# Altium schematic sheet PIC.SchDoc
size A
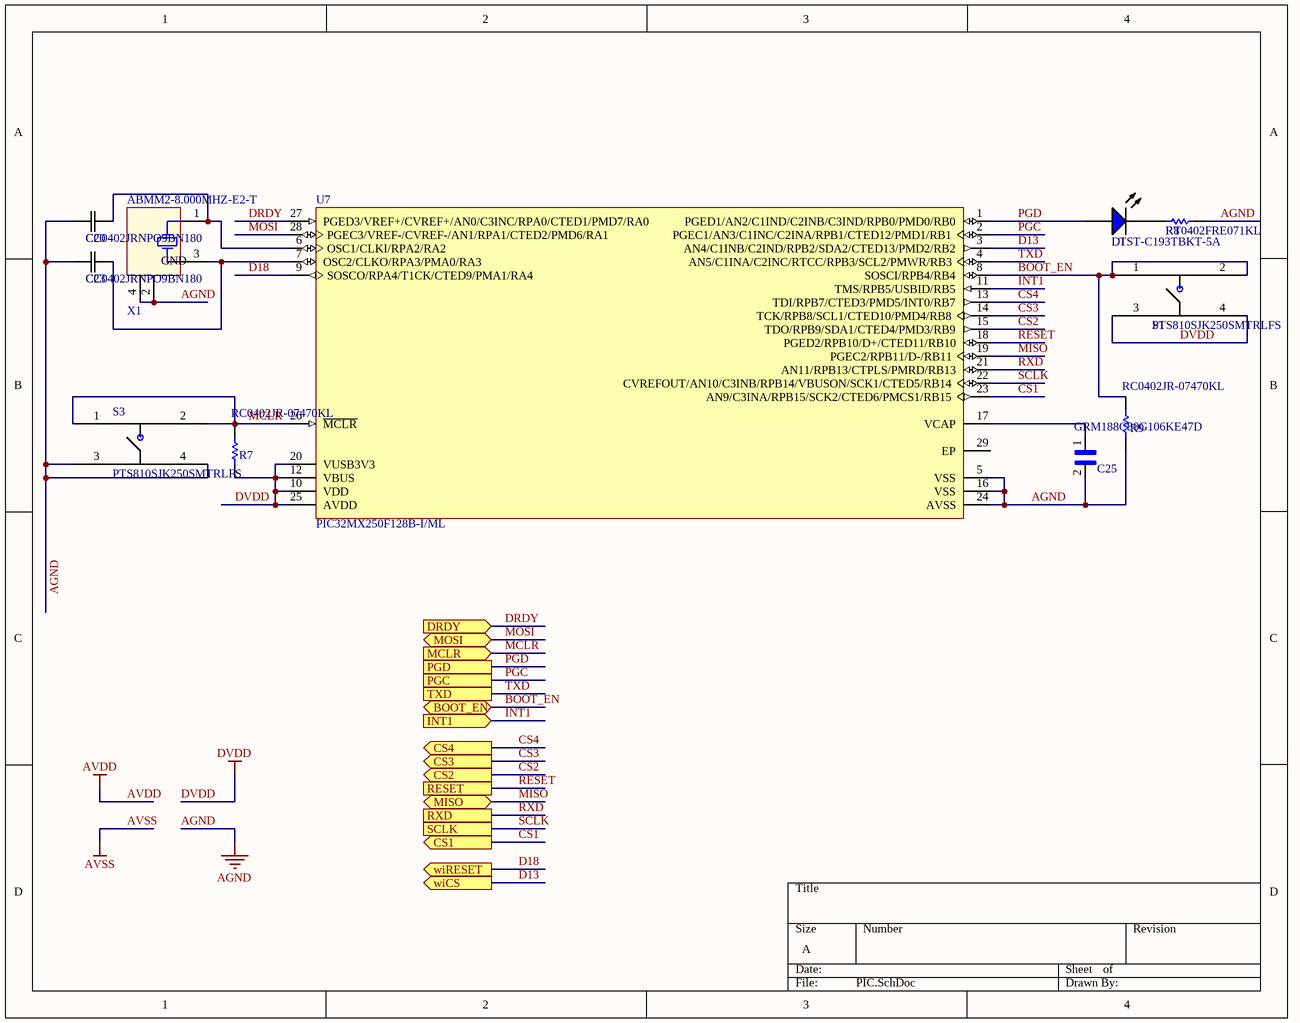
[diagram p0: PIC.SchDoc]

## Parts
C20  CC0402JRNPO9BN180  [YAG_CC0402]
C23  CC0402JRNPO9BN180  [YAG_CC0402]
C25  GRM188C80G106KE47D  [*CAPC1608X90N]
D1  LTST-C193TBKT-5A  [LTST-C193TBKT_V]
R7  RC0402JR-07470KL  [RESC0402(1005)_N]
R8  RT0402FRE071KL  [RESC1005X35X25NL10T10]
R9  RC0402JR-07470KL  [RESC0402(1005)_N]
S1  PTS810SJK250SMTRLFS  [PTS810]
S3  PTS810SJK250SMTRLFS  [PTS810]
U7  PIC32MX250F128B-I/ML  [MCHP-QFN-ML28_N]
X1  ABMM2-8.000MHZ-E2-T  [ABRA-ABMM2-4_V]

## Ports
BOOT_EN (bidir), CS1 (out), CS2 (out), CS3 (out), CS4 (out), DRDY (in), INT1 (in), MCLR (in), MISO (bidir), MOSI (bidir), PGC, PGD, RESET, RXD, SCLK, TXD, wiCS (out), wiRESET (out)

## Nets
AGND: C20.1 C23.1 C25.2 R8.2 R9.1 S3.3 S3.4 U7.5(VSS) U7.16(VSS) U7.24(AVSS) X1.2(GND) X1.4(GND)
DVDD: R7.2 S1.3 S1.4 U7.10(VDD) U7.12(VBUS) U7.20(VUSB3V3) U7.25(AVDD)
BOOT_EN: R9.2 S1.1 S1.2 U7.8(SOSCI/RPB4/RB4) ; port BOOT_EN
CS1: U7.23(AN9/C3INA/RPB15/SCK2/CTED6/PMCS1/RB15) ; port CS1
CS2: U7.15(TDO/RPB9/SDA1/CTED4/PMD3/RB9) ; port CS2
CS3: U7.14(TCK/RPB8/SCL1/CTED10/PMD4/RB8) ; port CS3
CS4: U7.13(TDI/RPB7/CTED3/PMD5/INT0/RB7) ; port CS4
D13: U7.3(AN4/C1INB/C2IND/RPB2/SDA2/CTED13/PMD2/RB2) ; port wiCS
D18: U7.9(SOSCO/RPA4/T1CK/CTED9/PMA1/RA4) ; port wiRESET
DRDY: U7.27(PGED3/VREF+/CVREF+/AN0/C3INC/RPA0/CTED1/PMD7/RA0) ; port DRDY
INT1: U7.11(TMS/RPB5/USBID/RB5) ; port INT1
MCLR: R7.1 S3.1 S3.2 U7.26(~{MCLR}) ; port MCLR
MISO: U7.19(PGEC2/RPB11/D-/RB11) ; port MISO
MOSI: U7.28(PGEC3/VREF-/CVREF-/AN1/RPA1/CTED2/PMD6/RA1) ; port MOSI
PGC: U7.2(PGEC1/AN3/C1INC/C2INA/RPB1/CTED12/PMD1/RB1) ; port PGC
PGD: D1.1(A) U7.1(PGED1/AN2/C1IND/C2INB/C3IND/RPB0/PMD0/RB0) ; port PGD
RESET: U7.18(PGED2/RPB10/D+/CTED11/RB10) ; port RESET
RXD: U7.21(AN11/RPB13/CTPLS/PMRD/RB13) ; port RXD
SCLK: U7.22(CVREFOUT/AN10/C3INB/RPB14/VBUSON/SCK1/CTED5/RB14) ; port SCLK
TXD: U7.4(AN5/C1INA/C2INC/RTCC/RPB3/SCL2/PMWR/RB3) ; port TXD
NetC20_2: C20.2 U7.6(OSC1/CLKI/RPA2/RA2) X1.1(X1)
NetC23_2: C23.2 U7.7(OSC2/CLKO/RPA3/PMA0/RA3) X1.3(X2)
NetC25_1: C25.1 U7.17(VCAP)
NetD1_2: D1.2(K) R8.1

Not connected (* = marked no-connect by the designer): U7 29(EP)

## Library data of the parts
C20 C23 = CC0402JRNPO9BN180: CAP CER 18PF 50V C0G/NPO 0402; Manufacturer 1: Yageo; Tolerance: 5%; Dielectric: C0G; Temperature Coefficient: 30ppm/°C; Supplier 1: Digi-Key; Manufacturer Part Number 1: CC0402JRNPO9BN180; Stock 1: 852660; Pricing 1: 1=0.10000, 10=0.02400, 100=0.01070, 500=0.00764, 1000=0.00601, 2500=0.00546, 5000=0.00502 (USD); RoHS: Yes; Mount: Surface Mount; Case/Package: 0402; Number of Pins: 2; Weight: 2.3E-05oz; Case Code (Metric): 1005; Case Code (Imperial): 0402; Min Operating Temperature: -55°C; Max Operating Temperature: 125°C; Capacitance: 18pF; Voltage Rating: 50V; Packaging: Tape and Reel; Package Quantity: 1; Voltage Rating (DC): 50V; Termination: SMD/SMT; Composition: Ceramic; Voltage: 50V; Length: 1mm; Height: 0.5mm; Width: 0.02inch; Thickness: 0.022inch; Depth: 0.5mm; Radiation Hardening: No; REACH SVHC: No SVHC; Lead Free: Lead Free; ComponentLink1URL: https://datasheet.ciiva.com/11788/0900766b80d84fbf-11788369.pdf?src-supplier=RSComponents; ComponentLink1Description: https://datasheet.ciiva.com/11788/0900766b80d84fbf-11788369.pdf?src-supplier=RSComponents; ComponentLink2URL: https://datasheet.ciiva.com/176/mlccorderingcode-176357.pdf?src-supplier=Digi-Key; ComponentLink2Description: https://datasheet.ciiva.com/176/mlccorderingcode-176357.pdf?src-supplier=Digi-Key; ComponentLink3URL: https://datasheet.ciiva.com/176/mlccorderingcode-176358.pdf?src-supplier=Digi-Key; ComponentLink3Description: https://datasheet.ciiva.com/176/mlccorderingcode-176358.pdf?src-supplier=Digi-Key; ComponentLink4URL: https://datasheet.ciiva.com/176/mlccorderingcode-176359.pdf?src-supplier=Digi-Key; ComponentLink4Description: https://datasheet.ciiva.com/176/mlccorderingcode-176359.pdf?src-supplier=Digi-Key; ComponentLink5URL: https://datasheet.ciiva.com/28450/1443161-28450232.pdf?src-supplier=Element14; ComponentLink5Description: https://datasheet.ciiva.com/28450/1443161-28450232.pdf?src-supplier=Element14; ComponentLink6URL: https://datasheet.ciiva.com/13208/upy-gp-np0-16v-to-50v-8-13208430.pdf?src-supplier=Mouser; ComponentLink6Description: https://datasheet.ciiva.com/13208/upy-gp-np0-16v-to-50v-8-13208430.pdf?src-supplier=Mouser; ComponentLink7URL: https://datasheet.ciiva.com/11587/upy-gp-np0-16v-to-50v-8-11587087.pdf?src-supplier=Avnet; ComponentLink7Description: https://datasheet.ciiva.com/11587/upy-gp-np0-16v-to-50v-8-11587087.pdf?src-supplier=Avnet; Supplier Part Number 1: 311-1415-1-ND
C25 = GRM188C80G106KE47D: CAP CER 10UF 4V X6S 0603; Manufacturer 1: Murata; Tolerance: 10%; Supplier 1: Digi-Key; Manufacturer Part Number 1: GRM188C80G106KE47D; Stock 1: 203819; Pricing 1: 1=0.17000, 10=0.11800, 100=0.05990, 500=0.04098, 1000=0.03625 (USD); RoHS: Yes; Mount: Surface Mount; Case/Package: 0603; Weight: 0.000222oz; Case Code (Metric): 1608; Case Code (Imperial): 0603; Min Operating Temperature: -55°C; Max Operating Temperature: 105°C; Capacitance: 10uF; Packaging: Tape and Reel; Voltage Rating: 4V; Dielectric: X6S; Termination: SMD/SMT; Voltage Rating (DC): 4V; Package Quantity: 4000; Length: 0.063inch; Height: 0.8mm; Width: 0.031inch; Thickness: 0.035inch; ComponentLink1URL: http://www.mouser.com/ds/2/281/c02e-2905.pdf?src-supplier=Mouser; ComponentLink1Description: http://www.mouser.com/ds/2/281/c02e-2905.pdf?src-supplier=Mouser; ComponentLink2URL: http://search.murata.co.jp/Ceramy/image/img/A01X/G101/ENG/GRM188C80G106KE47-01.pdf?src-supplier=Digi-Key; ComponentLink2Description: http://search.murata.co.jp/Ceramy/image/img/A01X/G101/ENG/GRM188C80G106KE47-01.pdf?src-supplier=Digi-Key; Supplier Part Number 1: 490-10469-1-ND
D1 = LTST-C193TBKT-5A: LED BLUE CLEAR CHIP SMD; Manufacturer 1: Vishay Lite-On; Lens Color: Colorless; Forward Current: 20mA; Forward Voltage: 2.8V; Luminous Intensity: 15mcd; Viewing Angle: 130°; Lens Style: Diffused,Colorless,Rectangular,Clear; Dominant Wavelength: 475nm; Test Current: 5mA; Number of Elements: 1; Power Dissipation: 76mW; Reverse Voltage: 5V; Supplier 1: Digi-Key; Manufacturer Part Number 1: LTST-C193TBKT-5A; Stock 1: 141970; Pricing 1: 1=0.45000, 10=0.32000, 100=0.14240, 500=0.09968, 1000=0.08188, 2500=0.07120 (USD); RoHS: Yes; Mount: Surface Mount; Case/Package: 0603; Number of Pins: 2; Color: Blue; Case Code (Metric): 1608; Case Code (Imperial): 0603; Min Operating Temperature: -20°C; Max Operating Temperature: 80°C; Packaging: Tape and Reel; Package Quantity: 1; Illumination Color: Blue; Lens Transparency: Clear; Number of LEDs: 1; Length: 1.6mm; Height: 0.35mm; Width: 0.8mm; Depth: 0.8mm; Radiation Hardening: No; Lead Free: Lead Free; ComponentLink1URL: https://datasheet.ciiva.com/4688/lite-on-ltst-c193tbkt-5a-187386-4688832.pdf?src-supplier=Mouser; ComponentLink1Description: https://datasheet.ciiva.com/4688/lite-on-ltst-c193tbkt-5a-187386-4688832.pdf?src-supplier=Mouser; ComponentLink2URL: https://datasheet.ciiva.com/2111/ltst-c193tbkt-5a-2111219.pdf?src-supplier=Digi-Key; ComponentLink2Description: https://datasheet.ciiva.com/2111/ltst-c193tbkt-5a-2111219.pdf?src-supplier=Digi-Key; ComponentLink3URL: https://datasheet.ciiva.com/15201/getdatasheetpartid-293056-15201395.pdf?src-supplier=Verical; ComponentLink3Description: https://datasheet.ciiva.com/15201/getdatasheetpartid-293056-15201395.pdf?src-supplier=Verical; ComponentLink4URL: https://datasheet.ciiva.com/11773/0900766b80dc0554-11773880.pdf?src-supplier=RSComponents; ComponentLink4Description: https://datasheet.ciiva.com/11773/0900766b80dc0554-11773880.pdf?src-supplier=RSComponents; ComponentLink5URL: https://datasheet.ciiva.com/16210/ltst-c193tbkt-5a-16210824.pdf?src-supplier=Future+Electronics; ComponentLink5Description: https://datasheet.ciiva.com/16210/ltst-c193tbkt-5a-16210824.pdf?src-supplier=Future+Electronics; ComponentLink6URL: https://datasheet.ciiva.com/2111/p-100-ltst-c193tbkt-5a-2111220.pdf?src-supplier=Digi-Key; ComponentLink6Description: https://datasheet.ciiva.com/2111/p-100-ltst-c193tbkt-5a-2111220.pdf?src-supplier=Digi-Key; ComponentLink7URL: https://datasheet.ciiva.com/2111/p-100-ltst-c193tbkt-5a-2111221.pdf?src-supplier=Digi-Key; ComponentLink7Description: https://datasheet.ciiva.com/2111/p-100-ltst-c193tbkt-5a-2111221.pdf?src-supplier=Digi-Key; Supplier Part Number 1: 160-1827-1-ND
R7 R9 = RC0402JR-07470KL: RES SMD 470K OHM 5% 1/16W 0402; Manufacturer 1: Yageo; Resistance: 470kR; Power Rating: 62.5mW; Voltage Rating: 50V; Temperature Coefficient: 100ppm/°C; Max Power Dissipation: 63mW; Supplier 1: Digi-Key; Manufacturer Part Number 1: RC0402JR-07470KL; Stock 1: 1799220; Pricing 1: 1=0.10000, 10=0.01300, 100=0.00550, 1000=0.00245, 2500=0.00212, 5000=0.00176 (USD); RoHS: Yes; Case/Package: 0402; Case Code (Metric): 1005; Case Code (Imperial): 0402; Min Operating Temperature: -55°C; Max Operating Temperature: 155°C; Package Quantity: 10000; Tolerance: 5%; Packaging: Tape and Reel; Composition: Thick Film; Number of Terminations: 2; Termination: SMD/SMT; Military Standard: Not; Working Voltage: 50V; Features: Moisture Resistant; Length: 1mm; Height: 0.016inch; Width: 0.02inch; Depth: 0.5mm; REACH SVHC: No SVHC; Lead Free: Lead Free; ComponentLink1URL: https://datasheet.ciiva.com/2452/pyu-r-int-thick-7-2452629.pdf?src-supplier=Digi-Key; ComponentLink1Description: https://datasheet.ciiva.com/2452/pyu-r-int-thick-7-2452629.pdf?src-supplier=Digi-Key; ComponentLink2URL: https://datasheet.ciiva.com/2452/pyu-r-int-thick-7-2452630.pdf?src-supplier=Digi-Key; ComponentLink2Description: https://datasheet.ciiva.com/2452/pyu-r-int-thick-7-2452630.pdf?src-supplier=Digi-Key; ComponentLink3URL: https://datasheet.ciiva.com/7850/1018594-7850214.pdf?src-supplier=Element14; ComponentLink3Description: https://datasheet.ciiva.com/7850/1018594-7850214.pdf?src-supplier=Element14; ComponentLink4URL: https://datasheet.ciiva.com/2452/pyu-r-int-thick-7-2452631.pdf?src-supplier=Digi-Key; ComponentLink4Description: https://datasheet.ciiva.com/2452/pyu-r-int-thick-7-2452631.pdf?src-supplier=Digi-Key; ComponentLink5URL: https://datasheet.ciiva.com/7850/1018594-7850215.pdf?src-supplier=Element14; ComponentLink5Description: https://datasheet.ciiva.com/7850/1018594-7850215.pdf?src-supplier=Element14; ComponentLink6URL: https://datasheet.ciiva.com/12667/pyu-rc0402-51-rohs-l-6-r-12667098.pdf?src-supplier=Mouser; ComponentLink6Description: https://datasheet.ciiva.com/12667/pyu-rc0402-51-rohs-l-6-r-12667098.pdf?src-supplier=Mouser; Supplier Part Number 1: 311-470KJRCT-ND
R8 = RT0402FRE071KL: Res Thin Film 0402 1K Ohm 1% 0.063W(1/16W) ???}50ppm/???? Molded SMD Paper T/R; Manufacturer 1: Yageo; Resistance: 1kR; Power Rating: 62.5mW; Voltage Rating: 50V; Max Power Dissipation: 63mW; Temperature Coefficient: 50ppm/°C; Supplier 1: Digi-Key; Manufacturer Part Number 1: RT0402FRE071KL; Stock 1: 113931; Pricing 1: 1=0.10000, 10=0.07200, 100=0.02770, 1000=0.01220, 2500=0.01053, 5000=0.00942 (USD); RoHS: Yes; Case/Package: 0402; Case Code (Metric): 1005; Case Code (Imperial): 0402; Contact Plating: Tin,Matte,Lead; Min Operating Temperature: -55°C; Max Operating Temperature: 125°C; Package Quantity: 10000; Packaging: Tape and Reel; Tolerance: 1%; Composition: Thin Film; Number of Terminations: 2; Termination: SMD/SMT; Military Standard: Not; Voltage Rating (DC): 50V; Features: Moisture Resistant; Length: 1mm; Height: 0.014inch; Width: 0.02inch; Depth: 0.5mm; Radiation Hardening: No; Lead Free: Lead Free; ComponentLink1URL: https://datasheet.ciiva.com/12834/pyu-rt-1-to-0-05-rohs-l-4-12834181.pdf?src-supplier=Mouser; ComponentLink1Description: https://datasheet.ciiva.com/12834/pyu-rt-1-to-0-05-rohs-l-4-12834181.pdf?src-supplier=Mouser; ComponentLink2URL: https://datasheet.ciiva.com/25647/pyu-rt-1-to-0-05-rohs-l-4-25647306.pdf?src-supplier=Digi-Key; ComponentLink2Description: https://datasheet.ciiva.com/25647/pyu-rt-1-to-0-05-rohs-l-4-25647306.pdf?src-supplier=Digi-Key; ComponentLink3URL: https://datasheet.ciiva.com/8896/pyu-rt-1-to-0-05-rohs-l-4-8896188.pdf?src-supplier=Avnet; ComponentLink3Description: https://datasheet.ciiva.com/8896/pyu-rt-1-to-0-05-rohs-l-4-8896188.pdf?src-supplier=Avnet; Supplier Part Number 1: YAG1234CT-ND
S1 S3 = PTS810SJK250SMTRLFS: SWITCH TACTILE SPST-NO 0.05A 16V; Manufacturer 1: ITT C&K; Mechanical Life: 50000Cycles; Throw Configuration: SPST; Operating Force: 260gf; Max Current Rating: 50mA; Illumination Type: Non-Illuminated; Switch Travel: 0.15mm; Switch Function: Off-Mom; Actuator Type: Standard; Supplier 1: Digi-Key; Manufacturer Part Number 1: PTS810SJK250SMTRLFS; Stock 1: 61508; Pricing 1: 1=0.30000, 10=0.28700, 25=0.27680, 50=0.26700, 100=0.25210, 250=0.23728, 500=0.22740, 1000=0.17302 (USD); RoHS: Yes; Mount: Surface Mount; Case/Package: SMD/SMT; Color: White; Contact Plating: Silver; Min Operating Temperature: -40°C; Max Operating Temperature: 85°C; Packaging: Tape and Reel; Current Rating: 50mA; Voltage Rating (DC): 16V; Package Quantity: 1; Termination: J-Bend; Orientation: Straight; Length: 3.2mm; Depth: 4.6mm; Lead Free: Lead Free; ComponentLink1URL: https://datasheet.ciiva.com/18514/pts810-4mar13-18514061.pdf?src-supplier=Digi-Key; ComponentLink1Description: https://datasheet.ciiva.com/18514/pts810-4mar13-18514061.pdf?src-supplier=Digi-Key; ComponentLink2URL: https://datasheet.ciiva.com/18514/pts810-4mar13-18514063.pdf?src-supplier=Digi-Key; ComponentLink2Description: https://datasheet.ciiva.com/18514/pts810-4mar13-18514063.pdf?src-supplier=Digi-Key; ComponentLink3URL: https://datasheet.ciiva.com/18514/pts810-4mar13-18514062.pdf?src-supplier=Digi-Key; ComponentLink3Description: https://datasheet.ciiva.com/18514/pts810-4mar13-18514062.pdf?src-supplier=Digi-Key; Supplier Part Number 1: CKN10503CT-ND
U7 = PIC32MX250F128B-I/ML: IC MCU 32BIT 128KB FLASH 28QFN; Manufacturer 1: Microchip; Frequency: 40MHz; RAM Size: 32KB; Max Supply Voltage: 3.6V; Min Supply Voltage: 2.3V; Interface: I2C,SPI,USB,IrDA,UART,USART,LIN,I2S; Number of Timers/Counters: 5; Data Bus Width: 32b; Number of Programmable I/O: 19; Watchdog Timer: Yes; Number of UART Channels: 2; Peripherals: I2C; Core Architecture: PIC; Supplier 1: Digi-Key; Manufacturer Part Number 1: PIC32MX250F128B-I/ML; Stock 1: 1377; Pricing 1: 1=3.79000, 25=3.47120, 100=3.15180 (USD); RoHS: Yes; Case/Package: QFN; Number of Pins: 28; Min Operating Temperature: -40°C; Max Operating Temperature: 85°C; Packaging: Rail/Tube; Package Quantity: 61; Max Frequency: 40MHz; Memory Type: FLASH; Memory Size: 128KB; Radiation Hardening: No; Lead Free: Lead Free; ComponentLink1URL: https://datasheet.ciiva.com/1580/61168e-1580882.pdf?src-supplier=Digi-Key; ComponentLink1Description: https://datasheet.ciiva.com/1580/61168e-1580882.pdf?src-supplier=Digi-Key; ComponentLink2URL: https://datasheet.ciiva.com/9242/61168d-9242380.pdf?src-supplier=Avnet; ComponentLink2Description: https://datasheet.ciiva.com/9242/61168d-9242380.pdf?src-supplier=Avnet; ComponentLink3URL: https://datasheet.ciiva.com/16476/61168e-16476910.pdf?src-supplier=Future+Electronics; ComponentLink3Description: https://datasheet.ciiva.com/16476/61168e-16476910.pdf?src-supplier=Future+Electronics; Supplier Part Number 1: PIC32MX250F128B-I/ML-ND
X1 = ABMM2-8.000MHZ-E2-T: CRYSTAL 8.0000MHZ 18PF SMD; Manufacturer 1: Abracon; Frequency Tolerance: 20ppm; ESR (Equivalent Series Resistance): 72R; Frequency: 8MHz; Supplier 1: Digi-Key; Manufacturer Part Number 1: ABMM2-8.000MHZ-E2-T; Stock 1: 81649; Pricing 1: 1=0.97000, 10=0.86000, 50=0.80420, 100=0.71060, 500=0.67320 (USD); RoHS: Yes; Case/Package: CSMD; Number of Pins: 4; Min Operating Temperature: -20°C; Max Operating Temperature: 70°C; Load Capacitance: 18pF; Tolerance: 20ppm; Package Quantity: 1000; Packaging: Tape and Reel; Frequency Stability: 20ppm; Termination: SMD/SMT; Composition: Ceramic; Series Resistance: 72R; Accuracy: 20ppm; Length: 6mm; Height: 0.047inch; Width: 3.6mm; Depth: 3.6mm; REACH SVHC: No SVHC; Lead Free: Lead Free; ComponentLink1URL: https://datasheet.ciiva.com/7998/1682206-7998656.pdf?src-supplier=Element14; ComponentLink1Description: https://datasheet.ciiva.com/7998/1682206-7998656.pdf?src-supplier=Element14; ComponentLink2URL: https://datasheet.ciiva.com/4945/abmm2-40161-4945441.pdf?src-supplier=Mouser; ComponentLink2Description: https://datasheet.ciiva.com/4945/abmm2-40161-4945441.pdf?src-supplier=Mouser; ComponentLink3URL: https://datasheet.ciiva.com/3176/abmm2-3176155.pdf?src-supplier=Avnet; ComponentLink3Description: https://datasheet.ciiva.com/3176/abmm2-3176155.pdf?src-supplier=Avnet; ComponentLink4URL: https://datasheet.ciiva.com/855/abmm2-855405.pdf?src-supplier=Digi-Key; ComponentLink4Description: https://datasheet.ciiva.com/855/abmm2-855405.pdf?src-supplier=Digi-Key; ComponentLink5URL: https://datasheet.ciiva.com/855/abmm2-855406.pdf?src-supplier=Digi-Key; ComponentLink5Description: https://datasheet.ciiva.com/855/abmm2-855406.pdf?src-supplier=Digi-Key; ComponentLink6URL: https://datasheet.ciiva.com/855/abmm2-855407.pdf?src-supplier=Digi-Key; ComponentLink6Description: https://datasheet.ciiva.com/855/abmm2-855407.pdf?src-supplier=Digi-Key; Supplier Part Number 1: 535-9628-1-ND